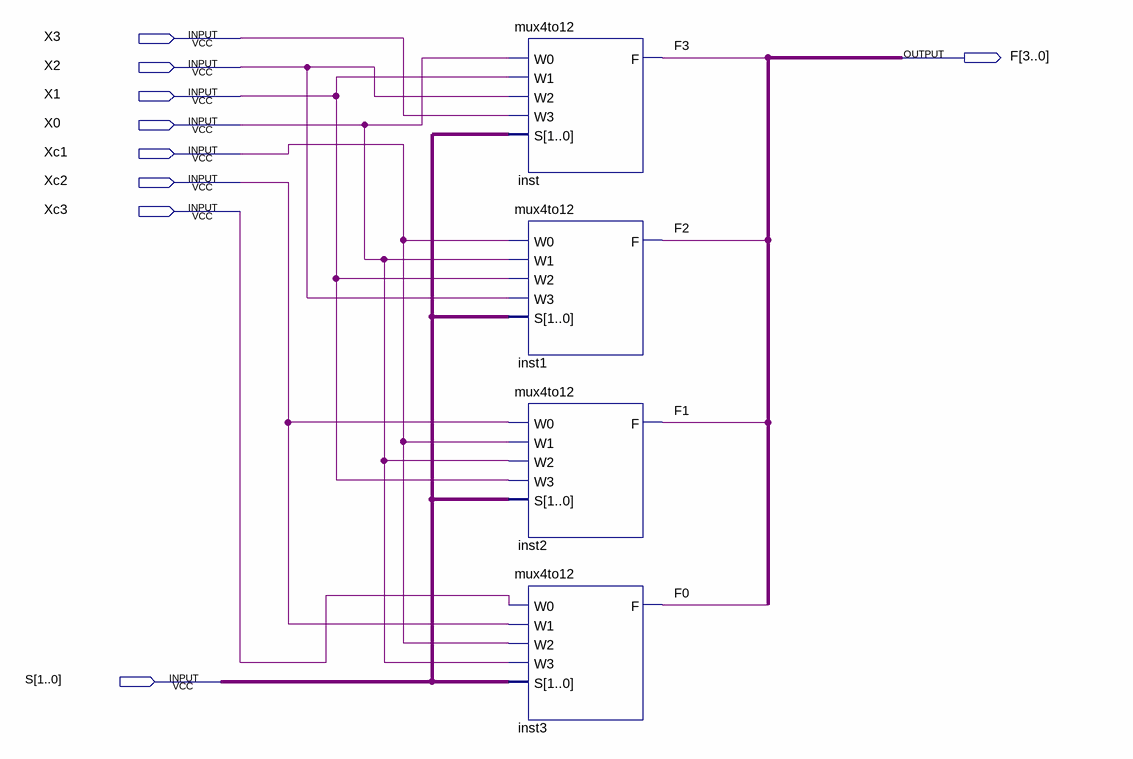
[diagram p0: schematic sheet]
// Quartus schematic lab8step3.bdf as structural Verilog: 4 symbols, 9 pins
module lab8step3 (
  input  X3,
  input  X2,
  input  X1,
  input  X0,
  input  Xc1,
  input  Xc2,
  input  Xc3,
  input  [1:0] S,
  output [3:0] F
);

  mux4to12 inst (.W0(X0), .W1(X1), .W2(X2), .W3(X3), .S(S), .F(F[3]));
  mux4to12 inst1 (.W0(Xc1), .W1(X0), .W2(X1), .W3(X2), .S(S), .F(F[2]));
  mux4to12 inst2 (.W0(Xc2), .W1(Xc1), .W2(X0), .W3(X1), .S(S), .F(F[1]));
  mux4to12 inst3 (.W0(Xc3), .W1(Xc2), .W2(Xc1), .W3(X0), .S(S), .F(F[0]));
endmodule
